# EAGLE design adaptor (EAGLE 7.7.0)
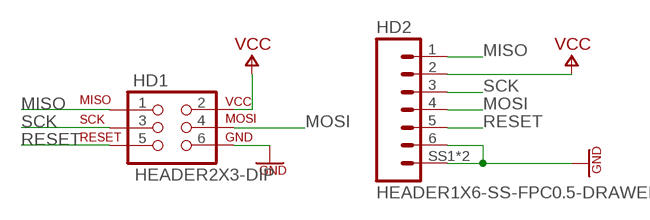
[diagram p0: schematic, sheet 1]

## Parts
HD1  HEADER2X3-DIP  [DIP2X3]
HD2  HEADER1X6-SS-FPC0.5-DRAWER  [FPC0.5-6-DRAWER]

## Nets
GND: HD1.6 HD2.6 HD2.SS1 HD2.SS2
MISO: HD1.1 HD2.1
MOSI: HD1.4 HD2.4
RESET: HD1.5 HD2.5
SCK: HD1.3 HD2.3
VCC: HD1.2 HD2.2

## Library data of the parts
HD1 = MyLibrary:HEADER2X3: 6-pin Header (2*3)
HD2 = MyLibrary:HEADER1X6-SS: 6-pin Header (1*6) 0.5mm Pitch Connectors For FPC/FFC

## Board
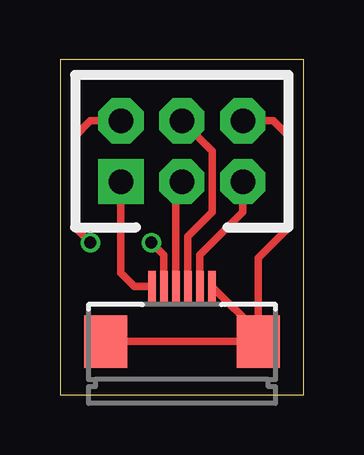
[diagram p1: board, top side]
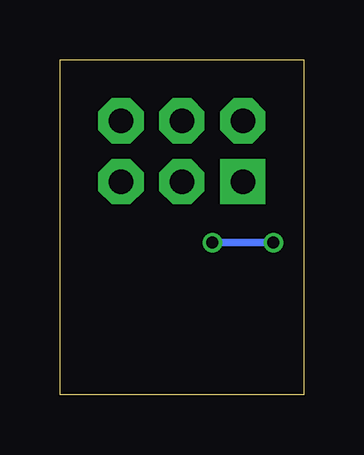
[diagram p2: board, bottom side, seen from below]

Size 10.16 x 13.97 mm. Coordinates in mm from the lower left corner, seen from the top.
Outline: 0,0 10.16,0 10.16,13.97 0,13.97 0,0
Copper layers (1*16): Top 0.035mm / dielectric 1.5mm / Bottom 0.035mm
Design rules "seeedStudio": minimum track width 6mil, minimum drill 12mil, track to track 6mil, track to pad 6mil, pad to pad 6mil, via to via 6mil, smd to smd 0mil, copper to edge 10mil, drill to drill 10mil, minimum pad ring 10mil, minimum via ring 6mil, stop-mask expansion 2mil, vias tented up to drill 100mil, thermal gap 10mil

### Footprints (pad centres in the part's own frame; a part is rotated, then mirrored left to right if it is on the bottom)
DIP2X3 = drill 1.016 pad 1.88 square: 1 -2.54,-1.27 | drill 1.016 pad 1.88 octagon: 2 -2.54,1.27; 3 0,-1.27; 4 0,1.27; 5 2.54,-1.27; 6 2.54,1.27
FPC0.5-6-DRAWER = smd 0.3 x 1.3: 1 -1.25,3.25; 2 -0.75,3.25; 3 -0.25,3.25; 4 0.25,3.25; 5 0.75,3.25; 6 1.25,3.25 | smd 1.8 x 2.2: SS1 -3.175,0.953; SS2 3.175,0.953

### Placement (x,y rotation side)
HD1  5.08,10.16 0 top
HD2  5.08,1.27 0 top

### Tracks (layer width: path | path; a pad name or v marks a point on that pad's centre or on a via)
GND
  Top 0.305: HD1.6 8.89,11.43 9.53,10.79 9.53,6.99 8.26,5.71 HD2.SS2 | HD2.SS2 HD2.SS1 | HD2.6 8.26,2.6 HD2.SS2
MISO
  Top 0.305: HD1.1 2.54,5.08 3.1,4.52 HD2.1
MOSI
  Top 0.305: HD1.4 6.35,10.16 6.35,7.62 5.33,6.6 HD2.4
RESET
  Top 0.305: HD1.5 7.62,7.62 5.83,5.83 HD2.5
SCK
  Top 0.254: HD1.3 4.83,8.64
  Top 0.305: 4.83,8.64 HD2.3
VCC  (via drill 0.5)
  Top 0.305: v1.27,6.35 0.64,6.99 0.64,10.79 1.27,11.43 HD1.2 | v3.81,6.35 4.33,5.83 HD2.2
  Bottom 0.305: v1.27,6.35 v3.81,6.35